# Altium schematic sheet eps_bb.SchDoc: Buck-Boost
size A4; DrawnBy: J. Reimer T. Yeung M. Au; Organization: UTAT SS; DocumentNumber: 5; Revision: 2.0; SheetNumber: 5; SheetTotal: 17
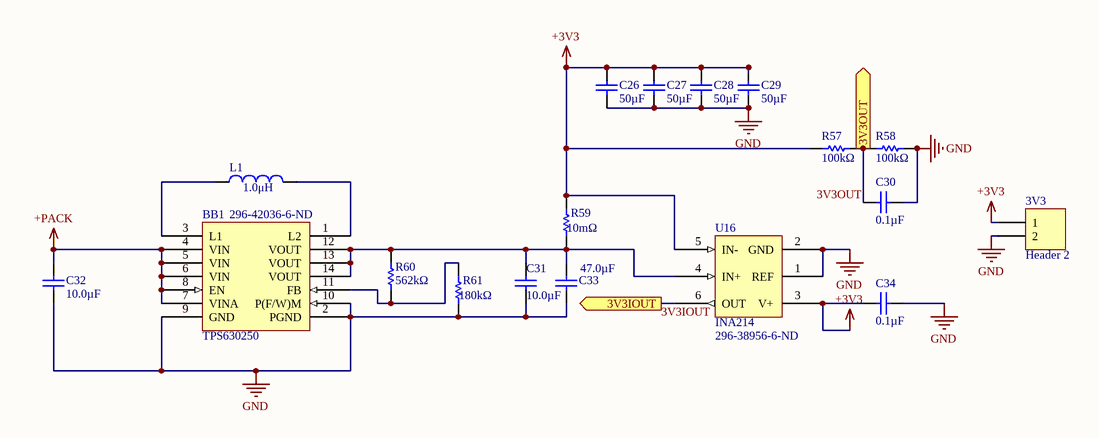
[diagram p0: eps_bb.SchDoc]

## Parts
3V3  Header 2  [CON2_SCREW_5.00MM_691102710002]
BB1  TPS630250  Supplier Part Number 1: 296-42036-6-ND  [RNC0014A]
C26  50µF  [1608[0603]]
C27  50µF  [1608[0603]]
C28  50µF  [1608[0603]]
C29  50µF  [1608[0603]]
C30  0.1µF  [1608[0603]]
C31  10.0µF  [1608[0603]]
C32  10.0µF  [1608[0603]]
C33  47.0µF  [1608[0603]]
C34  0.1µF  [1608[0603]]
L1  value 1.0μH  [XAL4020-102ME]  (hidden comment: Inductor)
R57  100kΩ  [1608[0603]]
R58  100kΩ  [1608[0603]]
R59  value 10mΩ  [C1206]  (hidden comment: Res1)
R60  562kΩ  [1608[0603]]
R61  180kΩ  [1608[0603]]
U16  INA214  Supplier Part Number 1: 296-38956-6-ND  [SOT65P210X110-6N]

## Ports
3V3IOUT (out), 3V3OUT (out)

## Nets
+3V3: 3V3.1 C26.2 C27.2 C28.2 C29.2 C34.2 R57.1 R59.2 U16.3(V+) U16.5(IN-)
+PACK: BB1.4(VIN) BB1.5(VIN) BB1.6(VIN) BB1.7(VINA) BB1.8(EN) C32.2
GND: 3V3.2 BB1.2(PGND) BB1.9(GND) BB1.10(P(F/W)M) C26.1 C27.1 C28.1 C29.1 C30.2 C31.1 C32.1 C33.1 C34.1 R58.2 R61.1 U16.1(REF) U16.2(GND)
3V3IOUT: U16.6(OUT) ; port 3V3IOUT
3V3OUT: C30.1 R57.2 R58.1 ; port 3V3OUT
NetBB1_1: BB1.1(L2) L1.2
NetBB1_3: BB1.3(L1) L1.1
NetBB1_11: BB1.11(FB) R60.2 R61.2
NetBB1_12: BB1.12(VOUT) BB1.13(VOUT) BB1.14(VOUT) C31.2 C33.2 R59.1 R60.1 U16.4(IN+)

## Library data of the parts
3V3 = Header 2: Battery Header, 2-Pin; LatestRevisionDate: 17-Jul-2002; LatestRevisionNote: Re-released for DXP Platform.; Publisher: Altium Limited; Supplier 1: Digi-Key; Supplier Part Number 1: WM1351-ND
BB1 = TPS630250: Buck-boost converter; Supplier 1: Digi-Key
C26-C30 = Cap: Capacitor; Published: 8-Jun-2000; LatestRevisionDate: 17-Jul-2002; LatestRevisionNote: Re-released for DXP Platform.; PackageReference: RAD-0.3; Publisher: Altium Limited; PackageDescription: Radial Cap, Thru-Hole; 2 Leads; 0.3 in Pin Spacing; Supplier 1: Digi-Key; Supplier Part Number 1: 311-1088-6-ND
  C26-C29: Value: 50µF
  C30: Value: 0.1µF
C31 = Cap: Capacitor, Coutx; Published: 8-Jun-2000; LatestRevisionDate: 17-Jul-2002; LatestRevisionNote: Re-released for DXP Platform.; PackageReference: RAD-0.3; Publisher: Altium Limited; PackageDescription: Radial Cap, Thru-Hole; 2 Leads; 0.3 in Pin Spacing; Value: 10.0µF; Supplier 1: Digi-Key; Supplier Part Number 1: 490-3896-6-ND
C32 = Cap: Cin, capacitor; Published: 8-Jun-2000; LatestRevisionDate: 17-Jul-2002; LatestRevisionNote: Re-released for DXP Platform.; PackageReference: RAD-0.3; Publisher: Altium Limited; PackageDescription: Radial Cap, Thru-Hole; 2 Leads; 0.3 in Pin Spacing; Value: 10.0µF; Supplier 1: Digi-Key; Supplier Part Number 1: 490-3896-6-ND
C33 = Cap: Capacitor, Coutbb1; Published: 8-Jun-2000; LatestRevisionDate: 17-Jul-2002; LatestRevisionNote: Re-released for DXP Platform.; PackageReference: RAD-0.3; Publisher: Altium Limited; PackageDescription: Radial Cap, Thru-Hole; 2 Leads; 0.3 in Pin Spacing; Value: 47.0µF; Supplier 1: Digi-Key; Supplier Part Number 1: 490-13245-1-ND
C34 = Cap Semi: Capacitor (Semiconductor SIM Model); Published: 8-Jun-2000; LatestRevisionDate: 29-May-2009; LatestRevisionNote: IPC-7351 Footprint Added.; PackageReference: C1206; Publisher: Altium Limited; PackageDescription: Chip Capacitor; Value: 0.1µF
L1 = Inductor: Inductor, buck-boost; Code_IEC: 1005; Published: 8-Jun-2000; LatestRevisionDate: 29-May-2009; LatestRevisionNote: IPC-7351 Footprint Added.; PackageReference: 0402-A; Publisher: Altium Limited; PackageDescription: Chip Inductor; Code_JEITA: 0402; Supplier 1: Digi-Key; Supplier Part Number 1: 541-1319-6-ND
R57-R59 = Res1: Resistor; Published: 8-Jun-2000; LatestRevisionDate: 17-Jul-2002; LatestRevisionNote: Re-released for DXP Platform.; PackageReference: AXIAL-0.3; Publisher: Altium Limited; PackageDescription: Axial Device, Thru-Hole; 2 Leads; 0.3 in Pin Spacing
  R57: Value: 100kΩ; Supplier 1: Digi-Key; Supplier Part Number 1: 541-100KHCT-ND
  R58: Value: 100kΩ
  R59: Supplier 1: Digi-Key; Supplier Part Number 1: P.010AVDKR-ND
R60 = Res1: Resistor, Rfbt_bb1; Published: 8-Jun-2000; LatestRevisionDate: 17-Jul-2002; LatestRevisionNote: Re-released for DXP Platform.; PackageReference: AXIAL-0.3; Publisher: Altium Limited; PackageDescription: Axial Device, Thru-Hole; 2 Leads; 0.3 in Pin Spacing; Value: 562kΩ; Supplier 1: Digi-Key; Supplier Part Number 1: P562KHDKR-ND
R61 = Res1: Resistor, Rfbb_bb1; Published: 8-Jun-2000; LatestRevisionDate: 17-Jul-2002; LatestRevisionNote: Re-released for DXP Platform.; PackageReference: AXIAL-0.3; Publisher: Altium Limited; PackageDescription: Axial Device, Thru-Hole; 2 Leads; 0.3 in Pin Spacing; Value: 180kΩ; Supplier 1: Digi-Key; Supplier Part Number 1: P180KHDKR-ND
U16 = INA214: Current monitor; Supplier 1: Digi-Key